# EAGLE design control board (EAGLE 9.6.2)
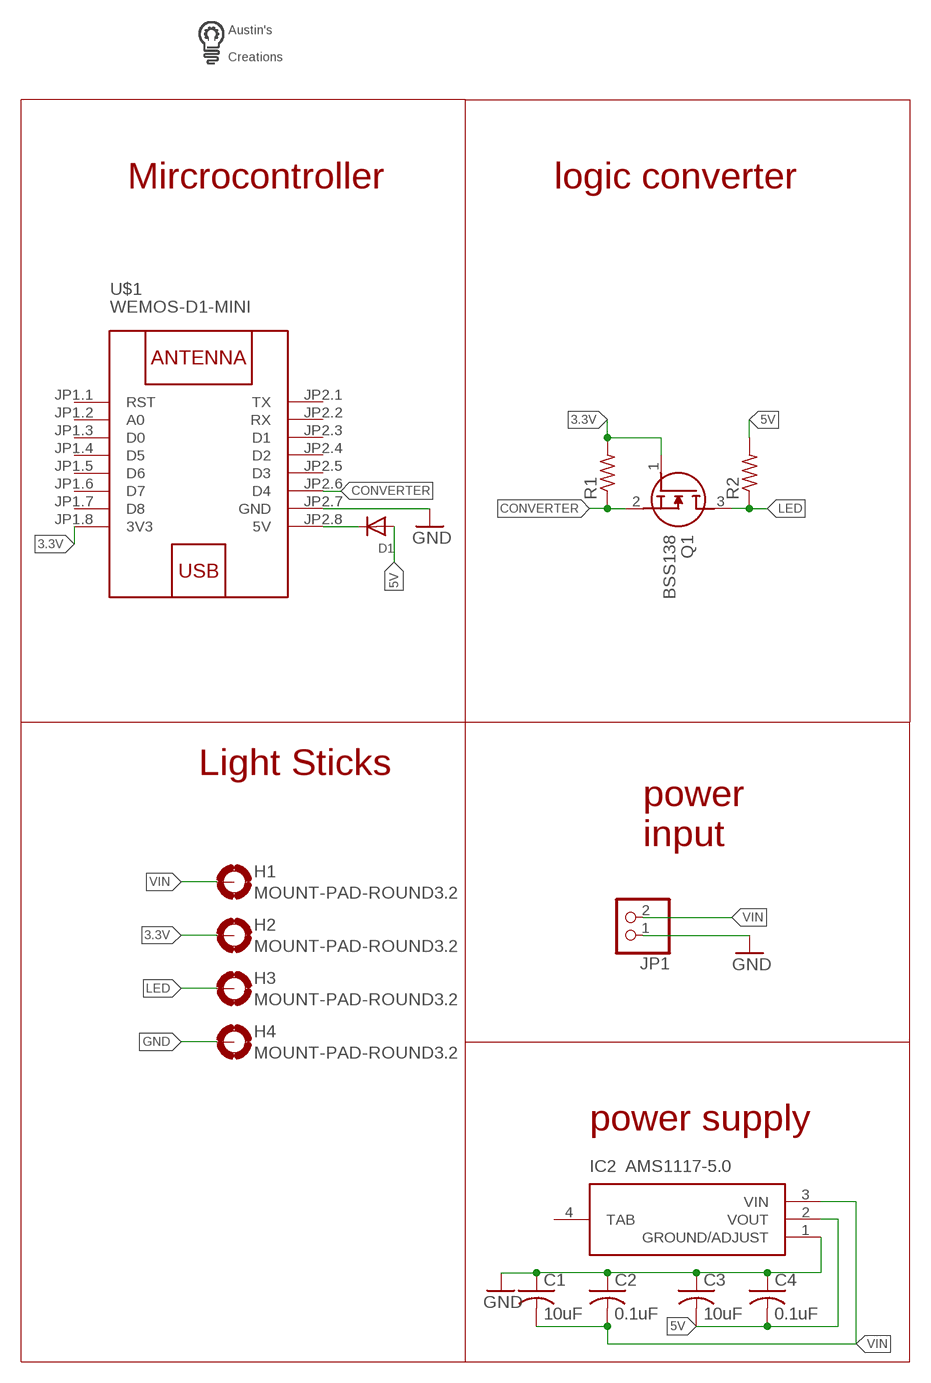
[diagram p0: schematic, sheet 1]

## Parts
C1  10uF  C-USC0603  [C0603]
C2  0.1uF  C-USC0603  [C0603]
C3  10uF  C-USC0603  [C0603]
C4  0.1uF  C-USC0603  [C0603]
D1  DIODESOD-123  [SOD-123]
H1  MOUNT-PAD-ROUND3.2  [3,2-PAD]
H2  MOUNT-PAD-ROUND3.2  [3,2-PAD]
H3  MOUNT-PAD-ROUND3.2  [3,2-PAD]
H4  MOUNT-PAD-ROUND3.2  [3,2-PAD]
IC2  AMS1117-5.0  [SOT229P700X180-4N]
JP1  PINHD-1X2  [1X02]
Q1  BSS138  [SOT95P240X120-3N]
R1  R-US_R0603  [R0603]
R2  R-US_R0603  [R0603]
U$1  WEMOS-D1-MINI  [WEMOS-D1-MINI]
U$2  LOGO  [LOGO]

## Nets
3.3V: H2.B3,2(MOUNT) Q1.1(G) R1.2 U$1.JP1.8(3V3)
5V: C3.2 C4.2 D1.A IC2.2(VOUT) R2.2
CONVERTER: Q1.2(S) R1.1 U$1.JP2.6(D4)
GND: C1.1 C2.1 C3.1 C4.1 H4.B3,2(MOUNT) IC2.1(GROUND/ADJUST) JP1.1 U$1.JP2.7(GND)
LED: H3.B3,2(MOUNT) Q1.3(D) R2.1
N$7: D1.C U$1.JP2.8(5V)
VIN: C1.2 C2.2 H1.B3,2(MOUNT) IC2.3(VIN) JP1.2
Unconnected: IC2.4(TAB) U$1.JP1.1(RST) U$1.JP1.2(A0) U$1.JP1.3(D0) U$1.JP1.4(D5) U$1.JP1.5(D6) U$1.JP1.6(D7) U$1.JP1.7(D8) U$1.JP2.1(TX) U$1.JP2.2(RX) U$1.JP2.3(D1) U$1.JP2.4(D2) U$1.JP2.5(D3)

## Notes on the sheet
- Mircrocontroller | logic converter
- Light Sticks
- power
  input
- power supply

## Library data of the parts
C1-C4 = adafruit:C-US: CAPACITOR, American symbol
D1 = adafruit:DIODE: Diode SMADIODE - SMA Surface Mount Package 20V 1A Schottky Diode Digikey: 641-1014-6-ND DO-1N4148 - Through Hole Small Current Diode SOD-123 20V 1 A (.5mV Vf) Schottky Diode - Digikey: MBRX120TPMSCT-ND SOD-323 10V 570mA (.38mV Vf, 3ns) Schottky Diode - Digikey: ZLLS410CT-ND SOD-523 30V 30mA Schottky Diode (RB751S-40TE61) - Digikey: RB751S-40TE61CT-ND SOT23-R/W - SOT23 Package (R = Solder Paste/Reflow Ovens, W = Hand-Soldering) BAT54Film 40V 300mA - Digikey: 497-7162-1-ND
H1-H4 = holes:MOUNT-PAD-ROUND: MOUNTING PAD, round
IC2 = SamacSys_Parts:AMS1117-5.0: 1A LOW DROPOUT VOLTAGE REGULATOR Source: Datasheet <http://www.advanced-monolithic.com/pdf/ds1117.pdf>; DESCRIPTION: 1A LOW DROPOUT VOLTAGE REGULATOR; HEIGHT: 1.8mm; MANUFACTURER_NAME: Advanced Monolithic Systems; MANUFACTURER_PART_NUMBER: AMS1117-5.0
JP1 = pinhead:PINHD-1X2: PIN HEADER
Q1 = SamacSys_Parts:BSS138: N-channel MOSFET,BSS138 0.2A 50V Source: Datasheet <https://www.onsemi.com/pub/Collateral/BSS138-D.PDF>; ARROW_PART_NUMBER: BSS138; ARROW_PRICE-STOCK: https://www.arrow.com/en/products/bss138/on-semiconductor; DESCRIPTION: N-channel MOSFET,BSS138 0.2A 50V; HEIGHT: 1.2mm; MANUFACTURER_NAME: ON Semiconductor; MANUFACTURER_PART_NUMBER: BSS138; MOUSER_PART_NUMBER: 512-BSS138; MOUSER_PRICE-STOCK: https://www.mouser.co.uk/ProductDetail/ON-Semiconductor-Fairchild/BSS138?qs=HK%252BeIG1iaahCeqBvjB4arg%3D%3D
R1 R2 = rcl:R-US_: RESISTOR, American symbol; SPICEPREFIX: R
U$1 = diy-modules:WEMOS-D1-MINI: WEMOS D1 mini: Mini Wi-Fi Board based on ESP-8266 device More details can be found here: https://www.wemos.cc/product/d1-mini.html Click here to find device on ebay.com <http://www.ebay.com/sch/wemos+d1+mini+nodemcu>
U$2 = custom parts:LOGO

## Board
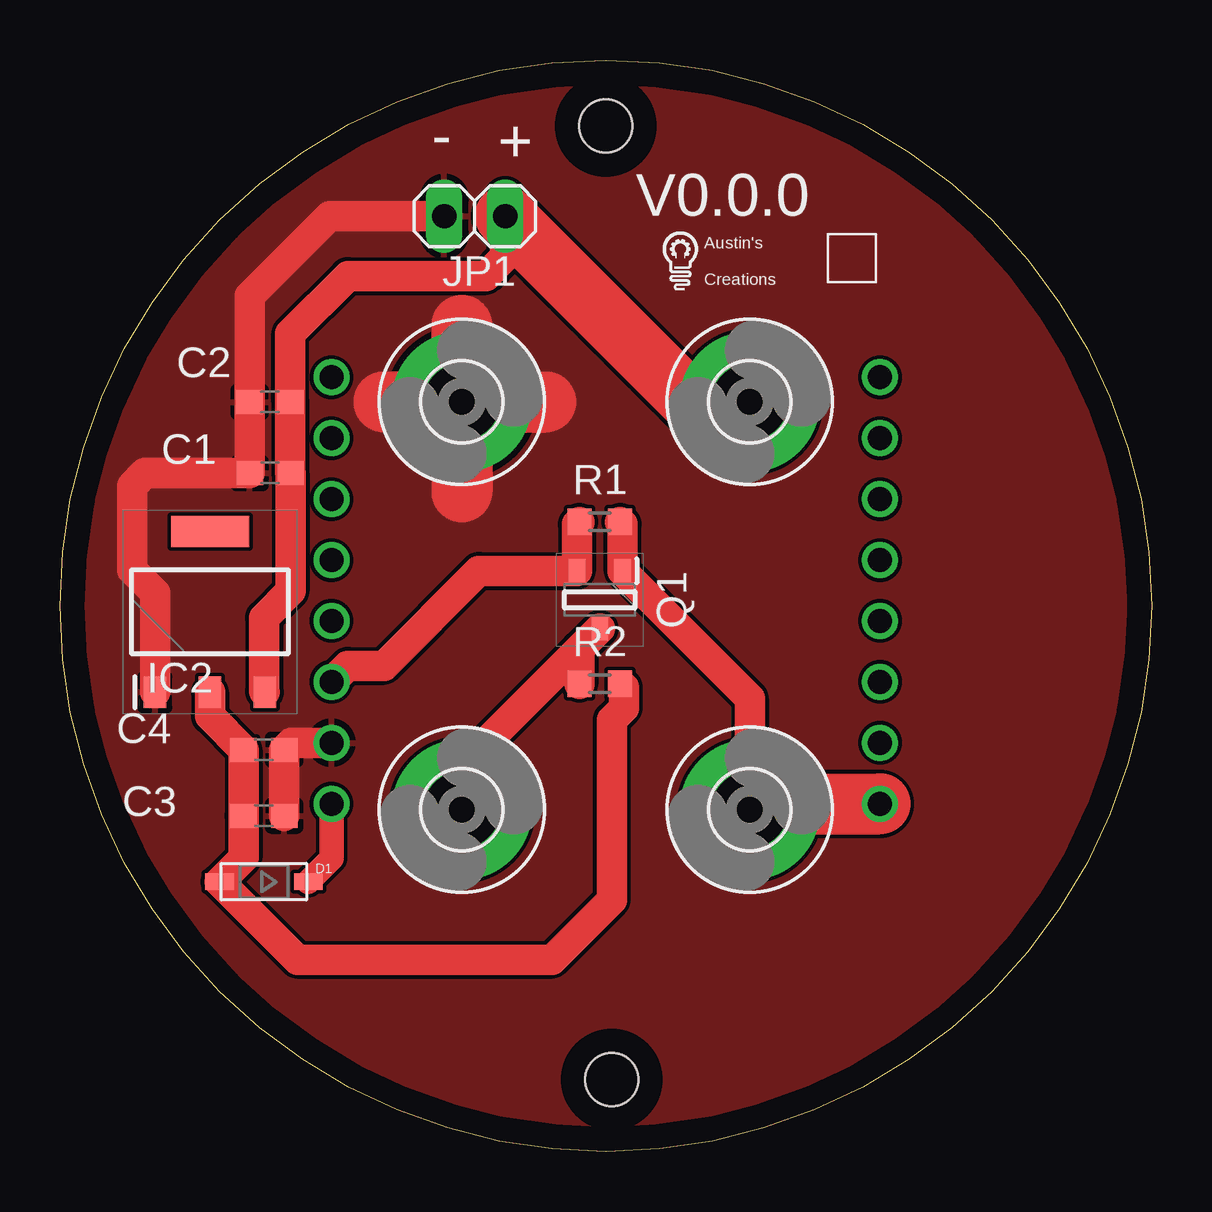
[diagram p1: board, top side]
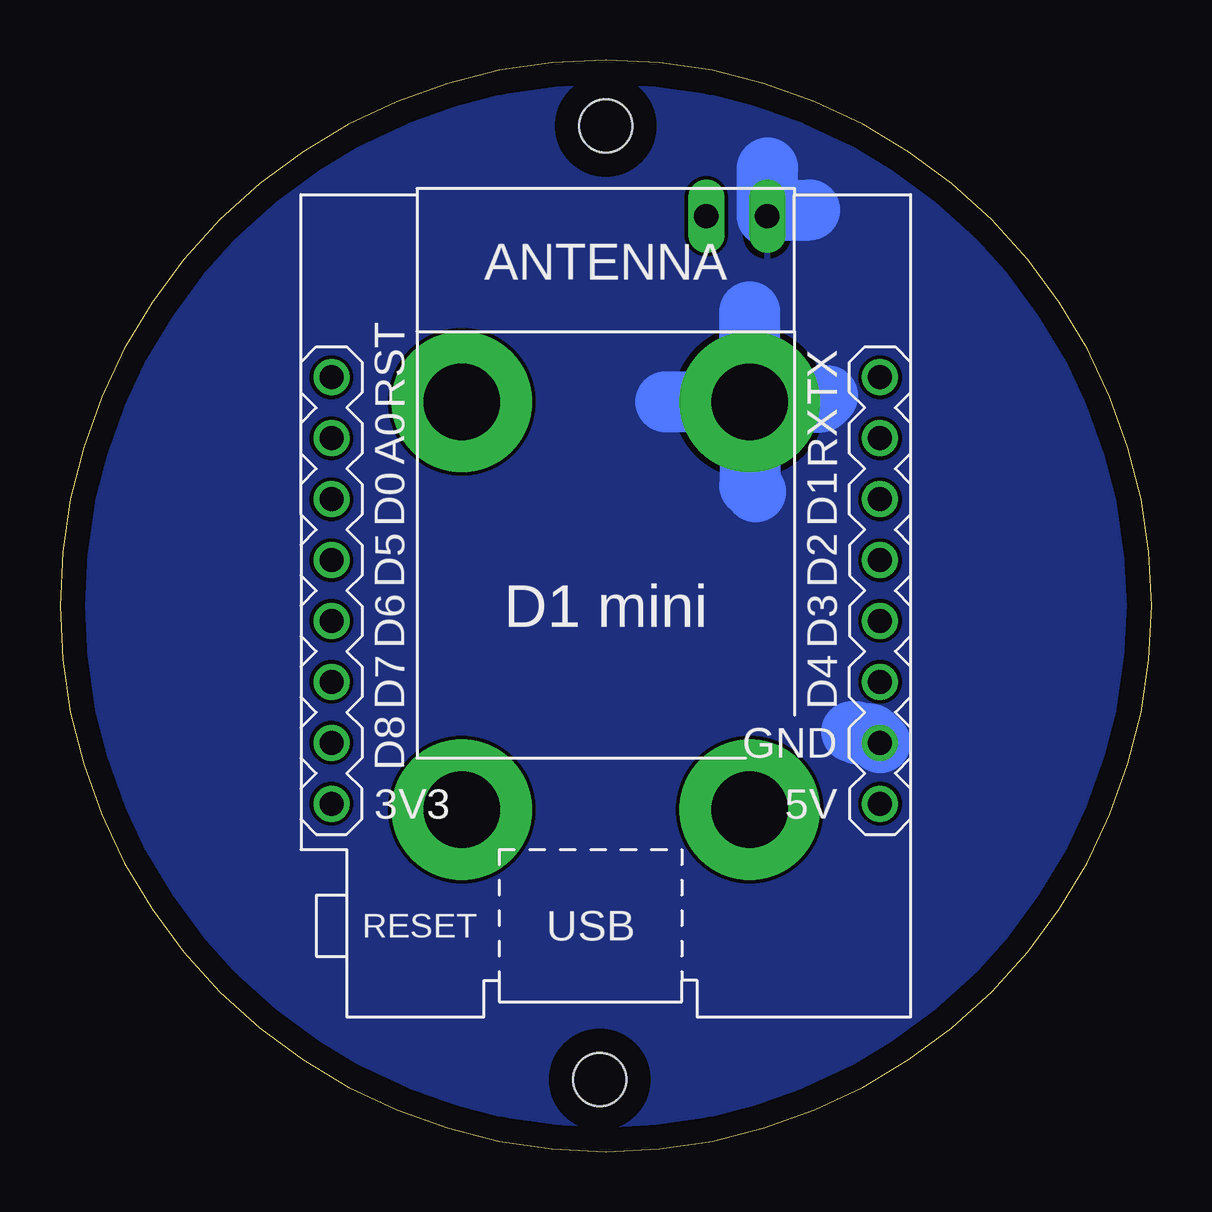
[diagram p2: board, bottom side, seen from below]

Size 45.5 x 45.5 mm. Coordinates in mm from the lower left corner, seen from the top.
Outline: 22.75,0 arc-180 22.75,45.5 arc-180 22.75,0
Copper layers (1*16): Top 0.035mm / dielectric 1.5mm / Bottom 0.035mm
Design rules "default *": minimum track width 10mil, minimum drill 0.35mm, track to track 6mil, track to pad 6mil, pad to pad 6mil, via to via 6mil, smd to smd 6mil, copper to edge 40mil, drill to drill 6mil, minimum pad ring 10mil, minimum via ring 8mil, stop-mask expansion 4mil, vias tented up to drill 0mil, thermal gap 10mil
Holes 2.2 mm at 22.75,42.75 23,3

### Footprints (pad centres in the part's own frame; a part is rotated, then mirrored left to right if it is on the bottom)
C0603 = smd 1.1 x 1: 1 -0.85,0; 2 0.85,0
SOD-123 = smd 1.2 x 0.7: A 1.85,0; C -1.85,0
3,2-PAD = drill 3.2 pad 5.842: B3,2 0,0
SOT229P700X180-4N = smd 1.3 x 0.95: 1 -3.35,2.29; 2 -3.35,0; 3 -3.35,-2.29 | smd 1.3 x 3.25: 4 3.35,0
1X02 = drill 1.016 long: 1 -1.27,0; 2 1.27,0
SOT95P240X120-3N = smd 1 x 0.7: 1 -1.2,0.95; 2 -1.2,-0.95; 3 1.2,0
R0603 = smd 1 x 1.1: 1 -0.85,0; 2 0.85,0
WEMOS-D1-MINI = drill 1: JP1.1 -11.43,9.525; JP1.2 -11.43,6.985; JP1.3 -11.43,4.445; JP1.4 -11.43,1.905; JP1.5 -11.43,-0.635; JP1.6 -11.43,-3.175; JP1.7 -11.43,-5.715; JP1.8 -11.43,-8.255; JP2.1 11.43,9.525; JP2.2 11.43,6.985; JP2.3 11.43,4.445; JP2.4 11.43,1.905; JP2.5 11.43,-0.635; JP2.6 11.43,-3.175; JP2.7 11.43,-5.715; JP2.8 11.43,-8.255

### Placement (x,y rotation side)
C1  8.76,28.28 0 top
C2  8.75,31.25 0 top
C3  8.5,14 180 top
C4  8.5,16.75 180 top
D1  8.5,11.25 180 top
H1  28.75,31.25 0 top
H2  28.75,14.25 0 top
H3  16.75,14.25 0 top
H4  16.75,31.25 0 top
IC2  6.25,22.5 90 top
JP1  17.29,38.99 0 top
Q1  22.5,23 270 top
R1  22.5,26.25 0 top
R2  22.5,19.5 0 top
U$1  22.75,22.75 0 bottom
U$2  25.14,35.91 0 top

### Tracks (layer width: path | path; a pad name or v marks a point on that pad's centre or on a via)
3.3V
  Top 1.27: R1.2 23.45,26.15 Q1.1 28.75,18.89 H2.B3,2
  Top 2.54: H2.B3,2 29,14.49 U$1.JP1.8
5V
  Top 0.813: 23.5,19.35 R2.2
  Top 1.27: IC2.2 6.25,18.15 C4.2 C3.2 7.65,12.25 D1.A 9.9,8 20.5,8 23,10.5 23,18 23.5,18.5 23.5,19.35
CONVERTER
  Top 1.27: R1.1 21.55,26.15 Q1.2 17.45,24.2 13.5,20.25 11.99,20.25 U$1.JP2.6
GND
  Top 1.27: C3.1 C4.1 9.63,17.04 U$1.JP2.7 | IC2.1 3.96,23.29 3,24.25 3,27.75 3.53,28.28 C1.1 7.91,31.24 C2.1 7.9,35.65 11.24,38.99 JP1.1
  Top 2.54: H4.B3,2 16.75,27.5 | H4.B3,2 16.75,34.44 | H4.B3,2 20.25,31.25 | H4.B3,2 13.5,31.25
  Bottom 2.54: 14.25,39.25 15.76,39.25 JP1.1 16.02,40.98 16,41 | H4.B3,2 16.75,27.75 16.5,27.5 | H4.B3,2 13.75,31.25 13.5,31.5 | H4.B3,2 16.75,35 | H4.B3,2 20.25,31.25 | U$1.JP2.7 11.68,17.4 12.22,17.4 12.32,17.5 12.5,17.5
  pour Bottom: 22.75,45.5 arc90 0,22.75 arc90 22.75,0 arc90 45.5,22.75 arc90
  pour Top: 22.75,45.5 arc90 0,22.75 arc90 22.75,0 arc90 45.5,22.75 arc90
LED
  Top 1.27: Q1.3 21.65,20.95 | 21.65,20.95 R2.1 | 21.65,20.95 16.75,16.05 H3.B3,2
N$7
  Top 1.016: U$1.JP2.8 11.32,12.22 D1.C
VIN
  Top 1.27: IC2.3 8.5,19.19 8.5,22.25 9.61,23.36 C1.2 9.6,28.29 C2.2 9.6,34.1 12,36.5 17.75,36.5 18.56,37.31 JP1.2
  Top 2.54: JP1.2 26.3,31.25 H1.B3,2

### Text on the board
tPlace: - | + | V0.0.0